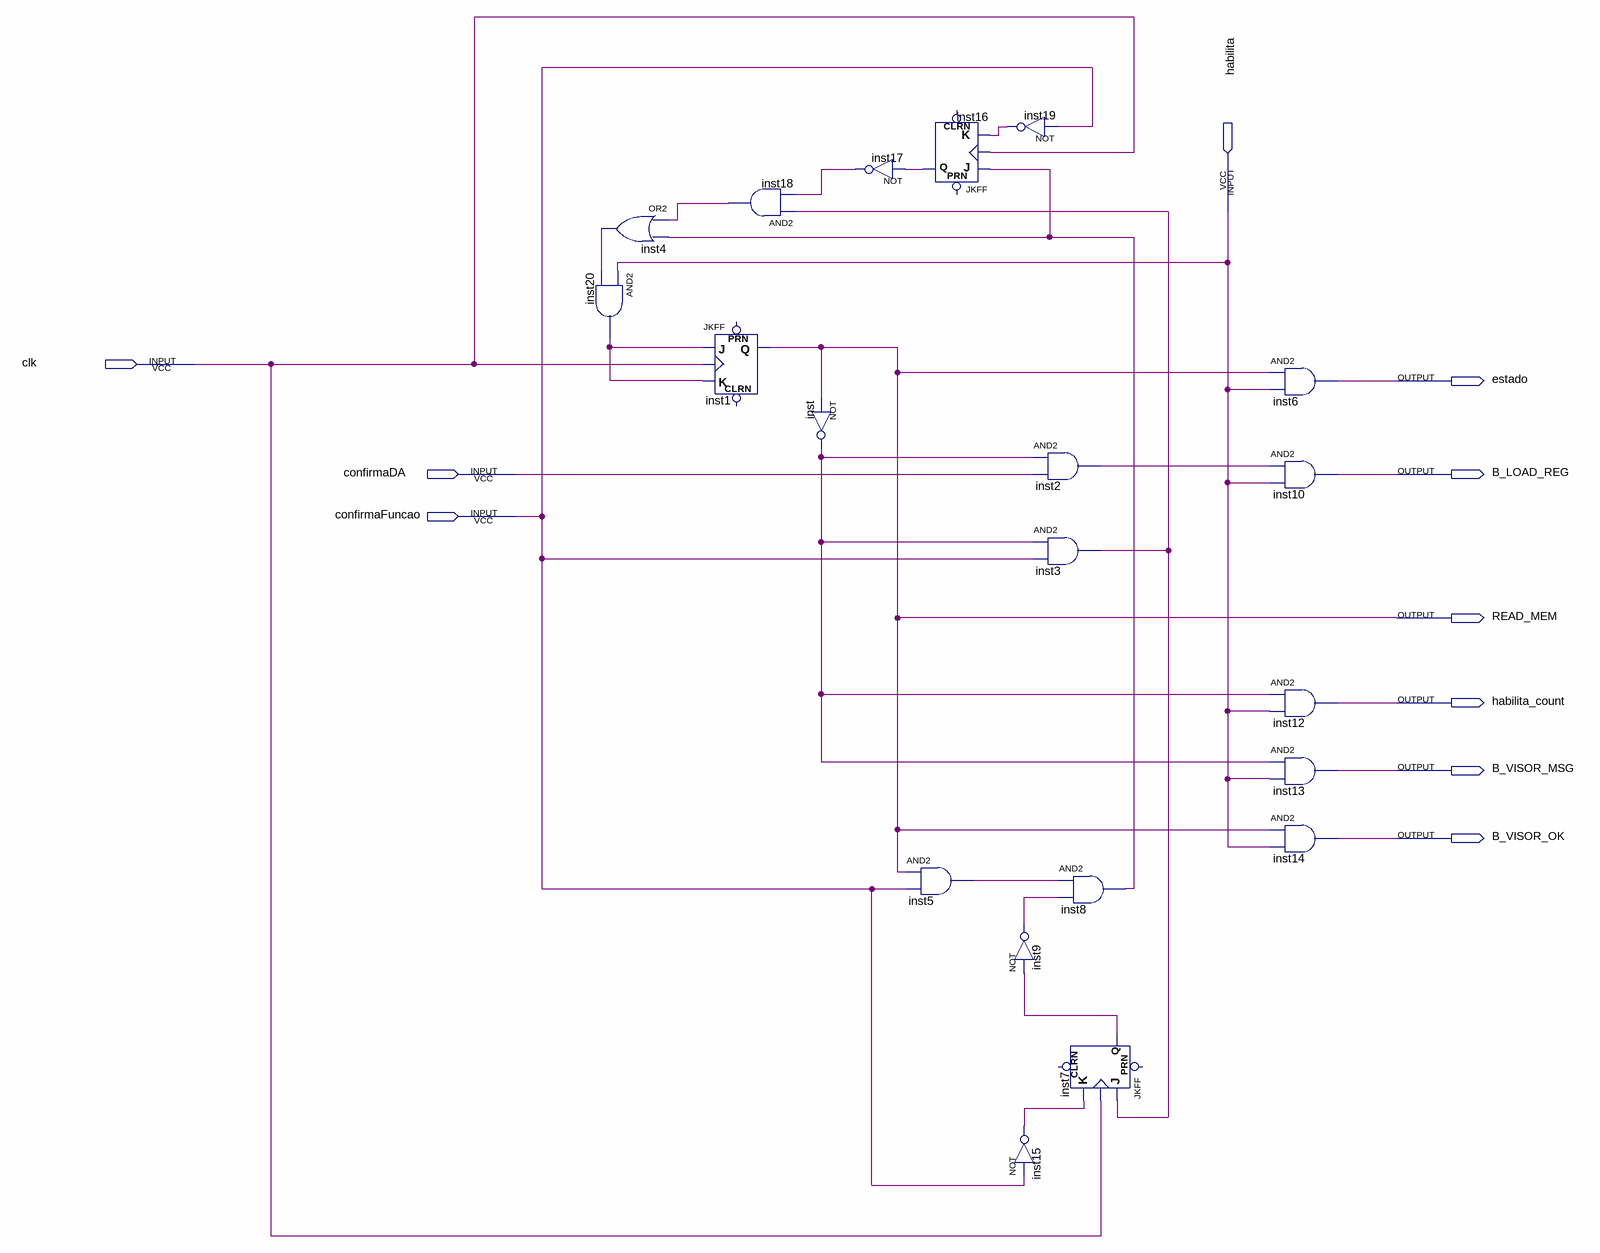
[diagram p0: schematic sheet]
// Quartus schematic MAQUINA_B.bdf as structural Verilog: 20 symbols, 10 pins
module MAQUINA_B (
  input  habilita,
  input  clk,
  input  confirmaDA,
  input  confirmaFuncao,
  output estado,
  output B_LOAD_REG,
  output READ_MEM,
  output habilita_count,
  output B_VISOR_MSG,
  output B_VISOR_OK
);

  wire inst2_out, inst3_out, inst4_out, inst5_out, inst7_q, inst8_out, inst9_out, inst15_out, inst16_q,
       inst17_out, inst18_out, inst19_out, inst20_out, inst_out;

  or inst4 (inst4_out, inst18_out, inst8_out);
  and inst20 (inst20_out, habilita, inst4_out);
  and inst18 (inst18_out, inst3_out, inst17_out);
  JKFF inst1 (.K(inst20_out), .J(inst20_out), .CLK(clk), .Q(READ_MEM));  // open: PRN, CLRN
  not inst (inst_out, READ_MEM);
  not inst17 (inst17_out, inst16_q);
  JKFF inst16 (.K(inst19_out), .J(inst8_out), .CLK(clk), .Q(inst16_q));  // open: PRN, CLRN
  and inst5 (inst5_out, READ_MEM, confirmaFuncao);
  not inst19 (inst19_out, confirmaFuncao);
  not inst9 (inst9_out, inst7_q);
  not inst15 (inst15_out, confirmaFuncao);
  and inst2 (inst2_out, inst_out, confirmaDA);
  and inst3 (inst3_out, inst_out, confirmaFuncao);
  and inst8 (inst8_out, inst5_out, inst9_out);
  JKFF inst7 (.K(inst15_out), .J(inst3_out), .CLK(clk), .Q(inst7_q));  // open: PRN, CLRN
  and inst6 (estado, READ_MEM, habilita);
  and inst10 (B_LOAD_REG, inst2_out, habilita);
  and inst12 (habilita_count, inst_out, habilita);
  and inst13 (B_VISOR_MSG, inst_out, habilita);
  and inst14 (B_VISOR_OK, READ_MEM, habilita);
endmodule
